# Altium schematic sheet NG2094_USB.SchDoc: =project_title
size Tabloid; PageSetup: Record=PageOptions|CenterHorizontal=True|CenterVertical=True|PrintScale=0.73|XCorrection=1.00|YCorrection=1.00|PrintKind=0|BorderSize=5000000|LeftOffset=0|BottomOffset=0|Orientation=2|PaperLength=1000|PaperWidth=1000|Scale=100|PaperSource=7|PrintQuality=-4|MediaType=1|DitherType=10|PaperKind=A4|PrintScaleMode=1; CompanyName: Luxonis Holding; Organization: Luxonis Holding; Address1: 1925 Harmony Park Drive; Address2: Westminster, CO; Address3: 80234; Address4: United States; SheetNumber: 8; SheetTotal: 12
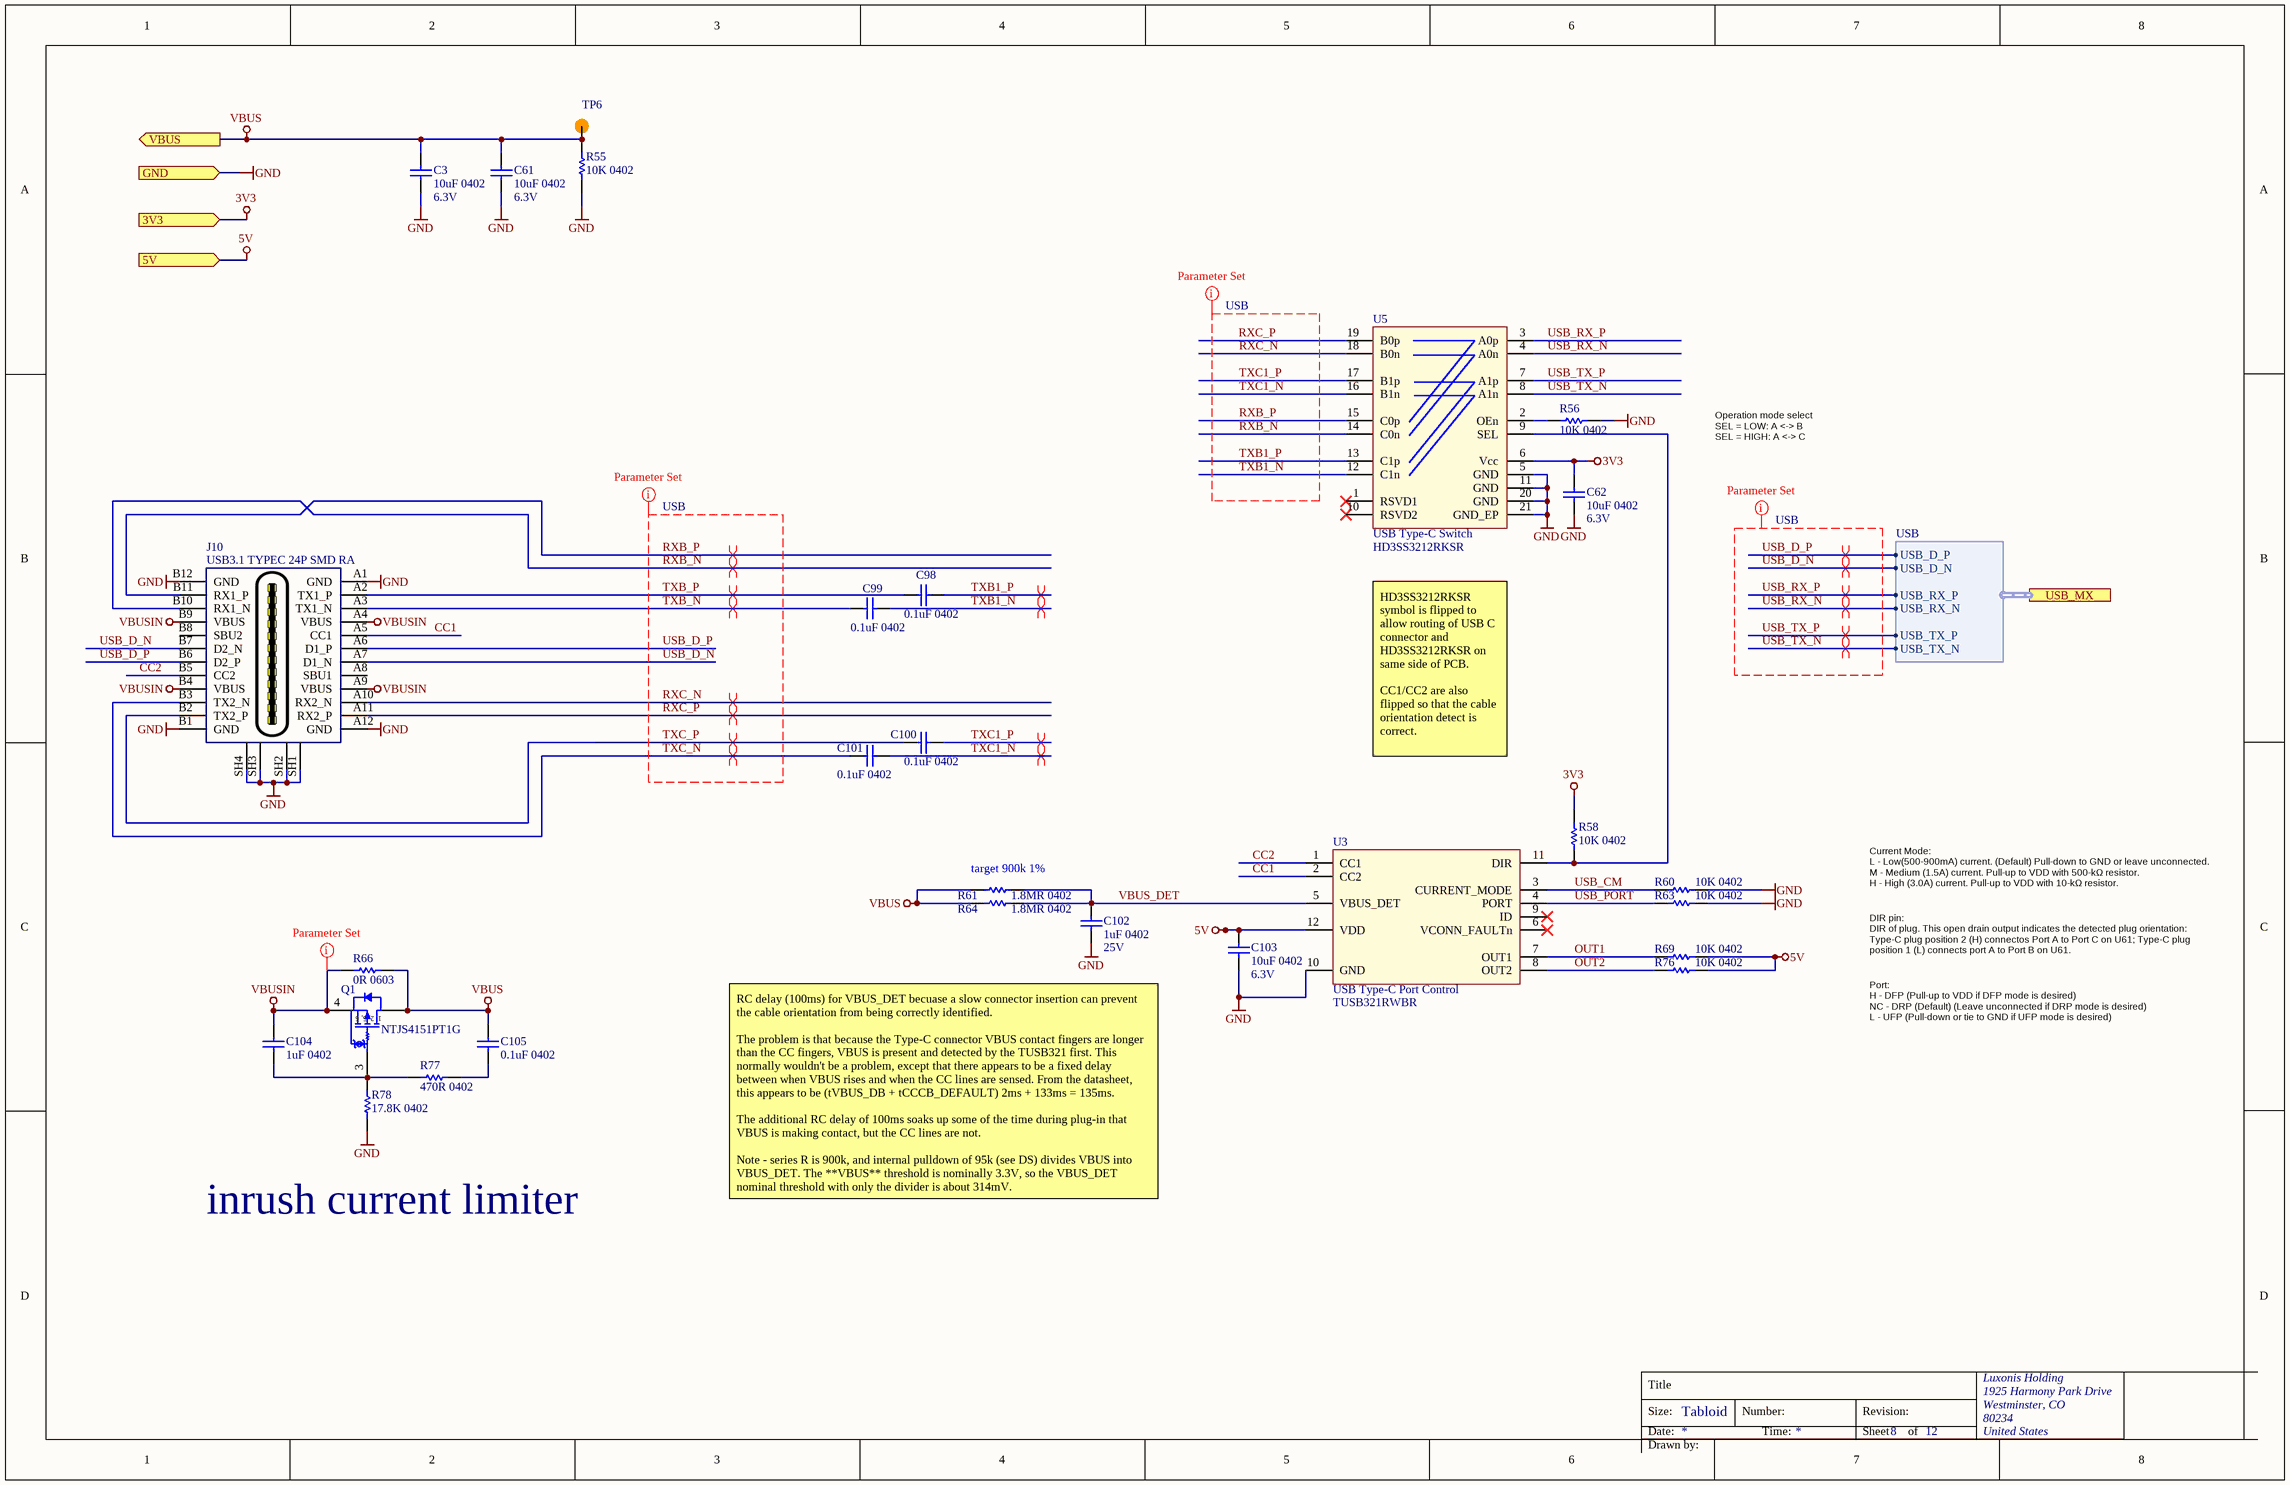
[diagram p0: NG2094_USB.SchDoc]

## Parts
C3  10uF 0402  Voltage Rating: 6.3V  [CAPC0402(1005)70_L]
C61  10uF 0402  Voltage Rating: 6.3V  [CAPC0402(1005)70_L]
C62  10uF 0402  Voltage Rating: 6.3V  [CAPC0402(1005)70_L]
C98  0.1uF 0402  [CAPC0402(1005)70_L]
C99  0.1uF 0402  [CAPC0402(1005)70_L]
C100  0.1uF 0402  [CAPC0402(1005)70_L]
C101  0.1uF 0402  [CAPC0402(1005)70_L]
C102  1uF 0402  Voltage Rating: 25V  [CAPC0402(1005)70_L]
C103  10uF 0402  Voltage Rating: 6.3V  [CAPC0402(1005)70_L]
C104  1uF 0402  [CAPC0402(1005)70_L]
C105  0.1uF 0402  [CAPC0402(1005)70_L]
J10  USB3.1 TYPEC 24P SMD RA  [105450-0101]
Q1  NTJS4151PT1G  [ONSC-SC70-6-419B-02_W_V]
R55  10K 0402  [RESC0402(1005)_L]
R56  10K 0402  [RESC0402(1005)_L]
R58  10K 0402  [RESC0402(1005)_L]
R60  10K 0402  [RESC0402(1005)_L]
R61  1.8MR 0402  [RESC0402(1005)_L]
R63  10K 0402  [RESC0402(1005)_L]
R64  1.8MR 0402  [RESC0402(1005)_L]
R66  0R 0603  [RESC0603(1608)_L]
R69  10K 0402  [RESC0402(1005)_L]
R76  10K 0402  [RESC0402(1005)_L]
R77  470R 0402  [RESC0402(1005)_L]
R78  17.8K 0402  [RESC0402(1005)_L]
TP6  TP100_200_NS  [TP100_200_NS]  (value not drawn)  (no BOM)
U3  USB Type-C Port Control  [TUSB321RWBR]
U5  USB Type-C Switch  [HD3SS3212RKSR]

## Ports
3V3 (in), 5V (in), GND (in), USB_MX (harness USB), VBUS (out)

## Harnesses
USB: USB_D_P, USB_D_N, USB_TX_N, USB_TX_P, USB_RX_N, USB_RX_P

## Nets
3V3: C62.2 R58.2 U5.6(Vcc) ; port 3V3
5V: C103.2 R69.2 R76.2 U3.12(VDD) ; port 5V
GND: C3.1 C61.1 C62.1 C102.1 C103.1 J10.A1(GND) J10.A12(GND) J10.B1(GND) J10.B12(GND) J10.SH1(SH) J10.SH2(SH) J10.SH3(SH) J10.SH4(SH) R55.1 R56.2 R60.2 R63.2 R78.1 U3.10(GND) U5.5(GND) U5.11(GND) U5.20(GND) U5.21(GND_EP) ; port GND
VBUS: C3.2 C61.2 C105.2 Q1.1(D) Q1.2(D) Q1.5(D) Q1.6(D) R55.2 R61.1 R64.1 R66.2 TP6.1 ; port VBUS
VBUSIN: C104.2 J10.A4(VBUS) J10.A9(VBUS) J10.B4(VBUS) J10.B9(VBUS) Q1.4(S) R66.1
CC1: J10.A5(CC1) U3.2(CC2)
CC2: J10.B5(CC2) U3.1(CC1)
OUT1: R69.1 U3.7(OUT1)
OUT2: R76.1 U3.8(OUT2)
RXB_N: J10.B10(RX1_N) U5.14(C0n)
RXB_P: J10.B11(RX1_P) U5.15(C0p)
RXC_N: J10.A10(RX2_N) U5.18(B0n)
RXC_P: J10.A11(RX2_P) U5.19(B0p)
TXB1_N: C99.2 U5.12(C1n)
TXB1_P: C98.2 U5.13(C1p)
TXB_N: C99.1 J10.A3(TX1_N)
TXB_P: C98.1 J10.A2(TX1_P)
TXC1_N: C101.2 U5.16(B1n)
TXC1_P: C100.2 U5.17(B1p)
TXC_N: C101.1 J10.B3(TX2_N)
TXC_P: C100.1 J10.B2(TX2_P)
USB_CM: R60.1 U3.3(CURRENT_MODE)
USB_D_N: J10.A7(D1_N) J10.B7(D2_N) ; port USB_MX.USB_D_N
USB_D_P: J10.A6(D1_P) J10.B6(D2_P) ; port USB_MX.USB_D_P
USB_PORT: R63.1 U3.4(PORT)
USB_RX_N: U5.4(A0n) ; port USB_MX.USB_RX_N
USB_RX_P: U5.3(A0p) ; port USB_MX.USB_RX_P
USB_TX_N: U5.8(A1n) ; port USB_MX.USB_TX_N
USB_TX_P: U5.7(A1p) ; port USB_MX.USB_TX_P
VBUS_DET: C102.2 R61.2 R64.2 U3.5(VBUS_DET)
NetC104_1: C104.1 Q1.3(G) R77.1 R78.2
NetC105_1: C105.1 R77.2
NetR56_1: R56.1 U5.2(OEn)
NetR58_1: R58.1 U3.11(DIR) U5.9(SEL)

Not connected (* = marked no-connect by the designer): J10 A8(SBU1) B8(SBU2); U3 6(VCONN_FAULTn)* 9(ID)*; U5 1(RSVD1)* 10(RSVD2)*

## Layout directives
differential pair; differential pair class USB3: RXB_N, RXB_P, RXC_N, RXC_P, TXB1_N, TXB1_P, TXB_N, TXB_P, TXC1_N, TXC1_P, TXC_N, TXC_P, USB_D_N, USB_D_P, USB_RX_N, USB_RX_P, USB_TX_N, USB_TX_P
net class USB: RXB_N, RXB_P, RXC_N, RXC_P, TXB1_N, TXB1_P, TXB_N, TXB_P, TXC1_N, TXC1_P, TXC_N, TXC_P, USB_D_N, USB_D_P, USB_RX_N, USB_RX_P, USB_TX_N, USB_TX_P
net class POWER: VBUSIN

## Notes on the sheet
- Operation mode select
  SEL = LOW: A <-> B
  SEL = HIGH: A <-> C
- HD3SS3212RKSR symbol is flipped to allow routing of USB C connector and HD3SS3212RKSR on same side of PCB.
  CC1/CC2 are also flipped so that the cable orientation detect is correct.
- (near R61) target 900k 1%
- Current Mode:
  L - Low(500-900mA) current. (Default) Pull-down to GND or leave unconnected.
  M - Medium (1.5A) current. Pull-up to VDD with 500-kΩ resistor.
  H - High (3.0A) current. Pull-up to VDD with 10-kΩ resistor.
- DIR pin:
  DIR of plug. This open drain output indicates the detected plug orientation: Type-C plug position 2 (H) connectos Port A to Port C on U61; Type-C plug position 1 (L) connects port A to Port B on U61.
- Port:
  H - DFP (Pull-up to VDD if DFP mode is desired)
  NC - DRP (Default) (Leave unconnected if DRP mode is desired)
  L - UFP (Pull-down or tie to GND if UFP mode is desired)
- inrush current limiter
- RC delay (100ms) for VBUS_DET becuase a slow connector insertion can prevent the cable orientation from being correctly identified.
  The problem is that because the Type-C connector VBUS contact fingers are longer than the CC fingers, VBUS is present and detected by the TUSB321 first. This normally wouldn't be a problem, except that there appears to be a fixed delay between when VBUS rises and when the CC lines are sensed. From the datasheet, this appears to be (tVBUS_DB + tCCCB_DEFAULT) 2ms + 133ms = 135ms.
  The additional RC delay of 100ms soaks up some of the time during plug-in that VBUS is making contact, but the CC lines are not.
  Note - series R is 900k, and internal pulldown of 95k (see DS) divides VBUS into VBUS_DET. The **VBUS** threshold is nominally 3.3V, so the VBUS_DET nominal threshold with only the divider is about 314mV.
- Title
- Size:
- Date:
- Tabloid
- Number:
- Time:
- Revision:
- Sheet
- of
- Drawn by:
- (in symbol NTJS4151PT1G) 1, 2, 5, 6

## Library data of the parts
C3 C61 C62 C103 = GRM155R60J106ME15D: CAP CER 10UF 6.3V X5R 0402 20%; Manufacturer 1: Murata; Supplier 1: Digi-Key; Manufacturer Part Number 1: GRM155R60J106ME15D; Stock 1: 1839627; Pricing 1: 1=0.23000, 10=0.15700, 100=0.07950, 500=0.05442, 1000=0.04814, 2500=0.04605, 5000=0.04186 (USD); RoHS: Yes; Mount: Surface Mount; Case/Package: 0402; Case Code (Metric): 1005; Case Code (Imperial): 0402; Min Operating Temperature: -55°C; Max Operating Temperature: 85°C; Packaging: Tape and Reel; Capacitance: 10uF; Dielectric: X5R; Length: 0.039inch; Width: 0.02inch; ComponentLink1URL: https://www.murata.com/~/media/webrenewal/support/library/catalog/products/capacitor/mlcc/c02e.ashx?la=en-us&src-supplier=Digi-Key; ComponentLink1Description: https://www.murata.com/~/media/webrenewal/support/library/catalog/products/capacitor/mlcc/c02e.ashx?la=en-us&src-supplier=Digi-Key; Supplier Part Number 1: 490-13238-1-ND; Voltage Rating (DC): 6.3V; Thickness: 0.026inch; Tolerance: 20%
C98-C101 C105 = GRM155R71A104JA01D: CAP CER 0.1UF 10V X7R 0402 5%; Manufacturer 1: Murata; Capacitance: 100nF; Supplier 1: Digi-Key; Manufacturer Part Number 1: GRM155R71A104JA01D; Stock 1: 1346709; Pricing 1: 1=0.10000, 10=0.02500, 100=0.01130, 500=0.00806, 1000=0.00633, 2500=0.00575, 5000=0.00529 (USD); RoHS: Yes; Mount: Surface Mount; Case/Package: 0402; Case Code (Imperial): 0402; Case Code (Metric): 1005; Min Operating Temperature: -55°C; Max Operating Temperature: 125°C; Tolerance: 5%; Packaging: Tape and Reel; Voltage Rating (DC): 10V; Dielectric: X7R; Package Quantity: 10000; Termination: SMD/SMT; Length: 1mm; Height: 0.5mm; Width: 0.02inch; Thickness: 0.022inch; Depth: 0.5mm; Radiation Hardening: No; Lead Free: Lead Free; ComponentLink1URL: https://datasheet.ciiva.com/5411/product-5411135.pdf?src-supplier=Mouser; ComponentLink1Description: https://datasheet.ciiva.com/5411/product-5411135.pdf?src-supplier=Mouser; ComponentLink2URL: https://datasheet.ciiva.com/11618/c02e-11618821.pdf?src-supplier=Avnet; ComponentLink2Description: https://datasheet.ciiva.com/11618/c02e-11618821.pdf?src-supplier=Avnet; Supplier Part Number 1: 490-10777-1-ND; Voltage Rating: 10V
C102 C104 = GRM155R61E105KA12D: CAP CER 1UF 25V X5R 0402 10%; Manufacturer 1: Murata; Material: Ceramic; Supplier 1: Digi-Key; Manufacturer Part Number 1: GRM155R61E105KA12D; Stock 1: 200653; Pricing 1: 1=0.10000, 10=0.07100, 100=0.03350, 500=0.02352, 1000=0.01947, 2500=0.01812, 5000=0.01658 (USD); RoHS: Yes; Mount: Surface Mount; Case/Package: 0402; Weight: 0.000212oz; Case Code (Metric): 1005; Case Code (Imperial): 0402; Min Operating Temperature: -55°C; Max Operating Temperature: 85°C; Tolerance: 10%; Capacitance: 1uF; Dielectric: X5R; Voltage Rating (DC): 25V; Packaging: Tape and Reel; Package Quantity: 10000; Termination: SMD/SMT; Voltage: 25V; Length: 1mm; Height: 0.5mm; Width: 0.5mm; Thickness: 0.022inch; Depth: 0.5mm; Lead Free: Lead Free; REACH SVHC: No SVHC; ComponentLink1URL: https://datasheet.ciiva.com/22732/1666664-22732122.pdf?src-supplier=Element14; ComponentLink1Description: https://datasheet.ciiva.com/22732/1666664-22732122.pdf?src-supplier=Element14; ComponentLink2URL: https://datasheet.ciiva.com/7719/1666664-7719006.pdf?src-supplier=Element14; ComponentLink2Description: https://datasheet.ciiva.com/7719/1666664-7719006.pdf?src-supplier=Element14; Supplier Part Number 1: 490-10017-1-ND; Supplier 2: Arrow; Supplier 3: TTI; Supplier Part Number 2: GRM155R61E105KA12D; Supplier Part Number 3: GRM155R61E105KA12D
  C104: Voltage Rating: 25V
J10 = 105450-0101: CONN RCP USB3.1 TYPEC 24P SMD RA; Manufacturer 1: Molex; Connector Type: USB; Number of Contacts: 24; Gender: Receptacle; Number of Ports: 1; Current Rating: 5A; Mating Cycles: 10000; Shielding: Shielded; Pitch: 0.5mm; Supplier 1: Digi-Key; Manufacturer Part Number 1: 105450-0101; Stock 1: 13882; Pricing 1: 1=2.15000, 10=1.94900, 25=1.82960, 50=1.75000, 100=1.67050, 250=1.51140, 500=1.39208 (USD); RoHS: Yes; Mount: Surface Mount,Through Hole,Horizontal; Case/Package: 0101; Number of Pins: 24; Contact Material: Copper Alloy; Contact Plating: Gold; Number of Terminals: 24; Housing Material: Thermoplastic; Insulation Color: Black; Min Operating Temperature: -30°C; Max Operating Temperature: 85°C; Packaging: Tape and Reel; Orientation: Right Angle; Termination: Solder; USB Standard: USB 3.1; Features: Shielded; Length: 8.94mm; REACH SVHC: Unknown; Flammability Rating: UL94 V-0; ComponentLink1URL: http://www.farnell.com/datasheets/2673427.pdf?src-supplier=Farnell; ComponentLink1Description: http://www.farnell.com/datasheets/2673427.pdf?src-supplier=Farnell; ComponentLink2URL: http://www.farnell.com/datasheets/2801634.pdf?src-supplier=Farnell; ComponentLink2Description: http://www.farnell.com/datasheets/2801634.pdf?src-supplier=Farnell; ComponentLink3URL: http://www.farnell.com/datasheets/2672741.pdf?src-supplier=Newark; ComponentLink3Description: http://www.farnell.com/datasheets/2672741.pdf?src-supplier=Newark; ComponentLink4URL: https://www.molex.com/pdm_docs/sd/1054500101_sd.pdf?src-supplier=Digi-Key; ComponentLink4Description: https://www.molex.com/pdm_docs/sd/1054500101_sd.pdf?src-supplier=Digi-Key; ComponentLink5URL: https://www.molex.com/pdm_docs/ps/PS-105448-001.pdf?src-supplier=Digi-Key; ComponentLink5Description: https://www.molex.com/pdm_docs/ps/PS-105448-001.pdf?src-supplier=Digi-Key; ComponentLink6URL: http://www.farnell.com/datasheets/2015275.pdf?src-supplier=Element14; ComponentLink6Description: http://www.farnell.com/datasheets/2015275.pdf?src-supplier=Element14; ComponentLink7URL: http://www.literature.molex.com/SQLImages/kelmscott/Molex/PDF_Images/987651-4081.PDF?src-supplier=Avnet; ComponentLink7Description: http://www.literature.molex.com/SQLImages/kelmscott/Molex/PDF_Images/987651-4081.PDF?src-supplier=Avnet; ComponentLink8URL: http://www.literature.molex.com/SQLImages/kelmscott/Molex/PDF_Images/987651-4081.PDF?src-supplier=Avnet+Asia; ComponentLink8Description: http://www.literature.molex.com/SQLImages/kelmscott/Molex/PDF_Images/987651-4081.PDF?src-supplier=Avnet+Asia; Supplier Part Number 1: WM12856CT-ND
Q1 = NTJS4151PT1G: Trench Power MOSFET, -20 V, -4.2 A, Single P-Channel, 6-Pin SC70, Pb-Free, Tape and Reel; Manufacturer 1: ON Semiconductor; VGS(th) Max (V): 1.2; VGS Max (V): 12; Crss Typ (pF): 110; Ciss Typ (pF): 850; PD Max (W): 1; Qrr Typ (nC): 0.23; ID Max (A): 4.2; Coss Typ (pF): 160; Channel Polarity: P Channel; V(BR)DSS Min (V): 20; Mounting Technology: Surface Mount; ComponentLink3Description: Package Specification; Packing: Tape and Reel; DatasheetVersion: Rev. 1; RoHS: Pb-Free; Configuration: Single; PackageReference: SC70-6-419B-02_W; PackageVersion: Rev. W; Package Type: SC-88-6 / SC-70-6 / SOT-363-6; ComponentLink3URL: http://www.onsemi.com/pub_link/Collateral/SMF05C-D.PDF; PackageDescription: 6-Pin Small Outline Transistor, Body 2 x 1.25 mm, Pitch 0.65 mm; PartNumber: NTJS4151PT1G; ComponentLink2Description: Datasheet; ComponentLink1Description: Manufacturer URL; ComponentLink2URL: http://www.onsemi.com/pub_link/Collateral/NTJS4151P-D.PDF; ComponentLink1URL: http://www.onsemi.com/; Manufacturer Part Number 1: NTJS4151PT1G
R55 R56 R58 R60 R63 R69 R76 = RC0402FR-1310KL: RES SMD 10K OHM 1% 0402 1/16W Chip Resistor, 0402 [1005 Metric], 10 kohm, RC Series, 50 V, Thick Film, 62.5 mW; Manufacturer 1: Yageo; Resistance: 10kR; Temperature Coefficient: 100ppm/°C; Power Rating: 62.5mW; Voltage Rating: 50V; ComponentLink1URL: https://datasheet.ciiva.com/16940/pyu-rc0402-51-rohs-l-6-16940293.pdf?src-supplier=Avnet+Europe; ComponentLink1Description: https://datasheet.ciiva.com/16940/pyu-rc0402-51-rohs-l-6-16940293.pdf?src-supplier=Avnet+Europe; ComponentLink2URL: https://datasheet.ciiva.com/28386/pyu-rc0402-51-rohs-l-6-28386855.pdf?src-supplier=Avnet+Europe; ComponentLink2Description: https://datasheet.ciiva.com/28386/pyu-rc0402-51-rohs-l-6-28386855.pdf?src-supplier=Avnet+Europe; ComponentLink3URL: https://datasheet.ciiva.com/16740/pyu-rc0402-51-rohs-l-6-r-16740602.pdf?src-supplier=Future+Electronics; ComponentLink3Description: https://datasheet.ciiva.com/16740/pyu-rc0402-51-rohs-l-6-r-16740602.pdf?src-supplier=Future+Electronics; ComponentLink4URL: https://datasheet.ciiva.com/8891/pyu-rc0402-51-rohs-l-6-8891339.pdf?src-supplier=Avnet; ComponentLink4Description: https://datasheet.ciiva.com/8891/pyu-rc0402-51-rohs-l-6-8891339.pdf?src-supplier=Avnet; ComponentLink5URL: https://datasheet.ciiva.com/5557/pyu-rc0402-51-rohs-l-6-r-5557997.pdf?src-supplier=Mouser; ComponentLink5Description: https://datasheet.ciiva.com/5557/pyu-rc0402-51-rohs-l-6-r-5557997.pdf?src-supplier=Mouser; ComponentLink6URL: https://datasheet.ciiva.com/7983/1018594-7983533.pdf?src-supplier=Element14; ComponentLink6Description: https://datasheet.ciiva.com/7983/1018594-7983533.pdf?src-supplier=Element14; Supplier 1: Newark; Manufacturer Part Number 1: RC0402FR-1310KL; Stock 1: 62239; Pricing 1: 1=0.10000, 25=0.01200, 100=0.00400, 250=0.00400, 500=0.00300, 1000=0.00300 (USD); RoHS: Yes; Case/Package: 0402; Number of Pins: 2; Contact Plating: Tin,Matte,Lead; Case Code (Imperial): 0402; Case Code (Metric): 1005; Min Operating Temperature: -55°C; Max Operating Temperature: 155°C; Tolerance: 1%; Composition: Thick Film; Packaging: Tape and Reel; Termination: SMD/SMT; Military Standard: Not; Voltage Rating (DC): 50V; Working Voltage: 50V; Number of Terminations: 2; Length: 1mm; Depth: 0.5mm; Radiation Hardening: No; REACH SVHC: No SVHC; Lead Free: Lead Free; Supplier Part Number 1: 67R9960
R61 R64 = CRCW04021M80FKED: RES SMD 1.8M OHM 1% 1/16W 0402; Manufacturer 1: Vishay; Voltage Rating: 50V; Temperature Coefficient: 100ppm/°C; Power Rating: 63mW; Supplier 1: Digi-Key; Manufacturer Part Number 1: CRCW04021M80FKED; Stock 1: 26061; Pricing 1: 1=0.10000, 10=0.03800, 100=0.01540, 1000=0.00690, 2500=0.00599, 5000=0.00495 (USD); RoHS: Yes; Mount: Surface Mount; Case/Package: 0402; Number of Pins: 2; Weight: 2.3E-05oz; Case Code (Imperial): 0402; Case Code (Metric): 1005; Contact Plating: Tin; Min Operating Temperature: -55°C; Max Operating Temperature: 155°C; Packaging: Tape and Reel; Package Quantity: 10000; Termination: SMD/SMT; Voltage Rating (DC): 50V; Composition: Thick Film; Tolerance: 1%; Military Standard: Not; Resistance: 1.8MR; Length: 1mm; Height: 0.35mm; Width: 0.5mm; Depth: 0.5mm; Radiation Hardening: No; Lead Free: Lead Free; REACH SVHC: Unknown; ComponentLink1URL: https://datasheet.ciiva.com/11812/0900766b80d98824-11812579.pdf?src-supplier=RSComponents; ComponentLink1Description: https://datasheet.ciiva.com/11812/0900766b80d98824-11812579.pdf?src-supplier=RSComponents; ComponentLink2URL: https://datasheet.ciiva.com/16886/dcrcwe3-16886536.pdf?src-supplier=Avnet+Europe; ComponentLink2Description: https://datasheet.ciiva.com/16886/dcrcwe3-16886536.pdf?src-supplier=Avnet+Europe; ComponentLink3URL: https://datasheet.ciiva.com/7800/1697337-7800987.pdf?src-supplier=Element14; ComponentLink3Description: https://datasheet.ciiva.com/7800/1697337-7800987.pdf?src-supplier=Element14; ComponentLink4URL: https://datasheet.ciiva.com/16786/70201119-16786875.pdf?src-supplier=Allied+Electronics; ComponentLink4Description: https://datasheet.ciiva.com/16786/70201119-16786875.pdf?src-supplier=Allied+Electronics; ComponentLink5URL: https://datasheet.ciiva.com/22676/1700796-22676027.pdf?src-supplier=Element14; ComponentLink5Description: https://datasheet.ciiva.com/22676/1700796-22676027.pdf?src-supplier=Element14; ComponentLink6URL: https://datasheet.ciiva.com/7800/1697337-7800988.pdf?src-supplier=Element14; ComponentLink6Description: https://datasheet.ciiva.com/7800/1697337-7800988.pdf?src-supplier=Element14; ComponentLink7URL: https://datasheet.ciiva.com/26316/fld-crcw-e3-data-en-26316605.pdf?src-supplier=Distrelec; ComponentLink7Description: https://datasheet.ciiva.com/26316/fld-crcw-e3-data-en-26316605.pdf?src-supplier=Distrelec; ComponentLink8URL: https://datasheet.ciiva.com/8336/dcrcwe3-8336646.pdf?src-supplier=Avnet; ComponentLink8Description: https://datasheet.ciiva.com/8336/dcrcwe3-8336646.pdf?src-supplier=Avnet; Supplier Part Number 1: 541-1.80MLCT-ND
R66 = CRCW06030000Z0EA: RES SMD 0 OHM JUMPER 1/10W 0603 0 Ohms Jumper 0.1W, 1/10W Chip Resistor 0603 (1608 Metric) Automotive AEC-Q200 Thick Film; Manufacturer 1: Vishay; Manufacturer Part Number 1: CRCW0603-0000Z0EA; Resistance: 0mR; Power Rating: 100mW; Voltage Rating: 75V; Temperature Coefficient: 100ppm/°C; Tolerance: 5%; Current Rating: 2A; Supplier 1: Digi-Key; Stock 1: 742743; Pricing 1: 1=0.100000, 10=0.034000, 25=0.024400, 50=0.018600, 100=0.013800, 250=0.010480, 500=0.008400, 1000=0.006180 (USD); RoHS: Yes; Mount: Surface Mount; Case/Package: 0603; Weight: 7.1E-05oz; Contact Plating: Tin,Lead; Case Code (Metric): 1608; Case Code (Imperial): 0603; Min Operating Temperature: -55°C; Max Operating Temperature: 155°C; Composition: Thick Film; Termination: SMD/SMT; Packaging: Tape and Reel; Package Quantity: 1; Number of Terminations: 2; Military Standard: Not; Max Power Dissipation: 100mW; Voltage Rating (DC): 75V; Features: Automotive AEC-Q200; Working Voltage: 75V; Length: 1.55mm; Height: 0.02inch; Width: 0.033inch; Depth: 0.85mm; Radiation Hardening: No; Lead Free: Lead Free; REACH SVHC: Unknown; ComponentLink1URL: https://datasheet.ciiva.com/2461/dcrcwe3-2461968.pdf?src-supplier=Digi-Key; ComponentLink1Description: https://datasheet.ciiva.com/2461/dcrcwe3-2461968.pdf?src-supplier=Digi-Key; ComponentLink2URL: https://datasheet.ciiva.com/2461/dcrcwe3-2461969.pdf?src-supplier=Digi-Key; ComponentLink2Description: https://datasheet.ciiva.com/2461/dcrcwe3-2461969.pdf?src-supplier=Digi-Key; ComponentLink3URL: https://datasheet.ciiva.com/2461/dcrcwe3-2461970.pdf?src-supplier=Digi-Key; ComponentLink3Description: https://datasheet.ciiva.com/2461/dcrcwe3-2461970.pdf?src-supplier=Digi-Key; ComponentLink4URL: https://datasheet.ciiva.com/8340/dcrcwe3-8340197.pdf?src-supplier=Avnet; ComponentLink4Description: https://datasheet.ciiva.com/8340/dcrcwe3-8340197.pdf?src-supplier=Avnet; ComponentLink5URL: https://datasheet.ciiva.com/16941/dcrcw-16941302.pdf?src-supplier=Avnet+Europe; ComponentLink5Description: https://datasheet.ciiva.com/16941/dcrcw-16941302.pdf?src-supplier=Avnet+Europe; ComponentLink6URL: https://datasheet.ciiva.com/16199/dcrcwe3-16199063.pdf?src-supplier=Future+Electronics; ComponentLink6Description: https://datasheet.ciiva.com/16199/dcrcwe3-16199063.pdf?src-supplier=Future+Electronics; ComponentLink7URL: https://datasheet.ciiva.com/16725/70201119-16725175.pdf?src-supplier=Allied+Electronics; ComponentLink7Description: https://datasheet.ciiva.com/16725/70201119-16725175.pdf?src-supplier=Allied+Electronics; ComponentLink8URL: https://datasheet.ciiva.com/26316/fld-crcw-e3-data-en-26316615.pdf?src-supplier=Distrelec; ComponentLink8Description: https://datasheet.ciiva.com/26316/fld-crcw-e3-data-en-26316615.pdf?src-supplier=Distrelec; ComponentLink9URL: https://datasheet.ciiva.com/5544/dcrcwe3-109170-5544344.pdf?src-supplier=Mouser; ComponentLink9Description: https://datasheet.ciiva.com/5544/dcrcwe3-109170-5544344.pdf?src-supplier=Mouser; ComponentLink10URL: https://datasheet.ciiva.com/7841/1720486-7841816.pdf?src-supplier=Element14; ComponentLink10Description: https://datasheet.ciiva.com/7841/1720486-7841816.pdf?src-supplier=Element14; ComponentLink11URL: https://datasheet.ciiva.com/7841/1720486-7841817.pdf?src-supplier=Element14; ComponentLink11Description: https://datasheet.ciiva.com/7841/1720486-7841817.pdf?src-supplier=Element14; ComponentLink12URL: https://datasheet.ciiva.com/7841/125364-7841818.pdf?src-supplier=Element14; ComponentLink12Description: https://datasheet.ciiva.com/7841/125364-7841818.pdf?src-supplier=Element14; ComponentLink13URL: https://datasheet.ciiva.com/16721/70201119-16721450.pdf?src-supplier=Allied+Electronics; ComponentLink13Description: https://datasheet.ciiva.com/16721/70201119-16721450.pdf?src-supplier=Allied+Electronics; Supplier Part Number 1: 541-0.0GCT-ND
R77 = CRCW0402470RFKED: RES SMD 470 OHM 1% 1/16W 0402; Manufacturer 1: Vishay; Temperature Coefficient: 100ppm/°C; Power Rating: 63mW; Voltage Rating: 50V; Supplier 1: Digi-Key; Manufacturer Part Number 1: CRCW0402470RFKED; Stock 1: 9199; Pricing 1: 1=0.10000, 10=0.03800, 100=0.01540, 1000=0.00690, 2500=0.00599, 5000=0.00495 (USD); RoHS: Yes; Mount: Surface Mount; Case/Package: 0402; Weight: 2.3E-05oz; Case Code (Imperial): 0402; Case Code (Metric): 1005; Contact Plating: Tin; Min Operating Temperature: -55°C; Max Operating Temperature: 155°C; Resistance: 470R; Tolerance: 1%; Composition: Thick Film; Packaging: Tape and Reel; Voltage Rating (DC): 50V; Termination: SMD/SMT; Number of Terminations: 2; Package Quantity: 10; Military Standard: Not; Max Power Dissipation: 63mW; Features: Automotive AEC-Q200; Length: 1mm; Height: 0.35mm; Width: 0.5mm; Depth: 0.5mm; Radiation Hardening: No; REACH SVHC: Unknown; Lead Free: Lead Free; ComponentLink1URL: https://datasheet.ciiva.com/11811/0900766b80d98824-11811416.pdf?src-supplier=RSComponents; ComponentLink1Description: https://datasheet.ciiva.com/11811/0900766b80d98824-11811416.pdf?src-supplier=RSComponents; ComponentLink2URL: https://datasheet.ciiva.com/16764/70201119-16764886.pdf?src-supplier=Allied+Electronics; ComponentLink2Description: https://datasheet.ciiva.com/16764/70201119-16764886.pdf?src-supplier=Allied+Electronics; ComponentLink3URL: https://datasheet.ciiva.com/28613/1720486-28613479.pdf?src-supplier=Element14; ComponentLink3Description: https://datasheet.ciiva.com/28613/1720486-28613479.pdf?src-supplier=Element14; ComponentLink4URL: https://datasheet.ciiva.com/3256/dcrcwe3-3256553.pdf?src-supplier=Avnet; ComponentLink4Description: https://datasheet.ciiva.com/3256/dcrcwe3-3256553.pdf?src-supplier=Avnet; ComponentLink5URL: https://datasheet.ciiva.com/7777/1720486-7777243.pdf?src-supplier=Element14; ComponentLink5Description: https://datasheet.ciiva.com/7777/1720486-7777243.pdf?src-supplier=Element14; ComponentLink6URL: https://datasheet.ciiva.com/8336/dcrcwe3-8336715.pdf?src-supplier=Avnet; ComponentLink6Description: https://datasheet.ciiva.com/8336/dcrcwe3-8336715.pdf?src-supplier=Avnet; ComponentLink7URL: https://datasheet.ciiva.com/7777/1697337-7777244.pdf?src-supplier=Element14; ComponentLink7Description: https://datasheet.ciiva.com/7777/1697337-7777244.pdf?src-supplier=Element14; ComponentLink8URL: https://datasheet.ciiva.com/2463/dcrcwe3-2463085.pdf?src-supplier=Digi-Key; ComponentLink8Description: https://datasheet.ciiva.com/2463/dcrcwe3-2463085.pdf?src-supplier=Digi-Key; ComponentLink9URL: https://datasheet.ciiva.com/16362/dcrcwe3-16362109.pdf?src-supplier=Future+Electronics; ComponentLink9Description: https://datasheet.ciiva.com/16362/dcrcwe3-16362109.pdf?src-supplier=Future+Electronics; ComponentLink10URL: https://datasheet.ciiva.com/16882/dcrcwe3-16882493.pdf?src-supplier=Avnet+Europe; ComponentLink10Description: https://datasheet.ciiva.com/16882/dcrcwe3-16882493.pdf?src-supplier=Avnet+Europe; ComponentLink11URL: https://datasheet.ciiva.com/2463/dcrcwe3-2463086.pdf?src-supplier=Digi-Key; ComponentLink11Description: https://datasheet.ciiva.com/2463/dcrcwe3-2463086.pdf?src-supplier=Digi-Key; ComponentLink12URL: https://datasheet.ciiva.com/2463/dcrcwe3-2463087.pdf?src-supplier=Digi-Key; ComponentLink12Description: https://datasheet.ciiva.com/2463/dcrcwe3-2463087.pdf?src-supplier=Digi-Key; Supplier 2: Newark; Supplier Part Number 1: 541-470LCT-ND; Supplier Part Number 2: 26W9133
R78 = ERJ-2RKF1782X: RES SMD 17.8K OHM 1% 1/10W 0402 17.8 kOhms ±1% 0.1W, 1/10W Chip Resistor 0402 (1005 Metric) Automotive AEC-Q200 Thick Film; Manufacturer 1: Panasonic; Temperature Coefficient: 100ppm/°C; Power Rating: 100mW; Voltage Rating: 50V; Resistance: 17.8kR; RoHS: Yes; Mount: Surface Mount; Case Code (Metric): 1005; Case Code (Imperial): 0402; Contact Plating: Tin; Min Operating Temperature: -55°C; Max Operating Temperature: 155°C; Packaging: Tape and Reel; Composition: Thick Film; Termination: SMD/SMT; Package Quantity: 1; Voltage Rating (DC): 50V; Military Standard: Not; Number of Terminations: 2; Max Power Dissipation: 100mW; Features: Automotive AEC-Q200; Length: 1mm; Height: 0.35mm; Width: 0.02inch; Depth: 0.5mm; Lead Free: Lead Free; REACH SVHC: Unknown; ComponentLink1URL: https://datasheet.ciiva.com/24027/aoa0000ce2-24027013.pdf?src-supplier=Mouser; ComponentLink1Description: https://datasheet.ciiva.com/24027/aoa0000ce2-24027013.pdf?src-supplier=Mouser; ComponentLink2URL: https://datasheet.ciiva.com/46372/1678782-46372997.pdf?src-supplier=Element14; ComponentLink2Description: https://datasheet.ciiva.com/46372/1678782-46372997.pdf?src-supplier=Element14; ComponentLink3URL: https://datasheet.ciiva.com/28594/1694929-28594534.pdf?src-supplier=Element14; ComponentLink3Description: https://datasheet.ciiva.com/28594/1694929-28594534.pdf?src-supplier=Element14; ComponentLink4URL: https://datasheet.ciiva.com/46372/1678782-46372998.pdf?src-supplier=Element14; ComponentLink4Description: https://datasheet.ciiva.com/46372/1678782-46372998.pdf?src-supplier=Element14; ComponentLink5URL: https://datasheet.ciiva.com/22764/1678782-22764807.pdf?src-supplier=Farnell; ComponentLink5Description: https://datasheet.ciiva.com/22764/1678782-22764807.pdf?src-supplier=Farnell; ComponentLink6URL: https://datasheet.ciiva.com/16769/70260748-16769816.pdf?src-supplier=Allied+Electronics; ComponentLink6Description: https://datasheet.ciiva.com/16769/70260748-16769816.pdf?src-supplier=Allied+Electronics; ComponentLink7URL: https://datasheet.ciiva.com/30116/aoa0000ce2-30116554.pdf?src-supplier=Onlinecomponents.com; ComponentLink7Description: https://datasheet.ciiva.com/30116/aoa0000ce2-30116554.pdf?src-supplier=Onlinecomponents.com; ComponentLink8URL: https://datasheet.ciiva.com/16775/70260748-16775211.pdf?src-supplier=Allied+Electronics; ComponentLink8Description: https://datasheet.ciiva.com/16775/70260748-16775211.pdf?src-supplier=Allied+Electronics; ComponentLink9URL: https://datasheet.ciiva.com/43467/1678782-43467419.pdf?src-supplier=Farnell; ComponentLink9Description: https://datasheet.ciiva.com/43467/1678782-43467419.pdf?src-supplier=Farnell; ComponentLink10URL: https://datasheet.ciiva.com/22668/1678782-22668623.pdf?src-supplier=Element14; ComponentLink10Description: https://datasheet.ciiva.com/22668/1678782-22668623.pdf?src-supplier=Element14; Supplier 1: Digi-Key; Manufacturer Part Number 1: ERJ-2RKF1782X; Stock 1: 250542; Pricing 1: 1=0.10000, 10=0.04500, 100=0.01830, 1000=0.00823, 2500=0.00715, 5000=0.00590 (USD); Case/Package: 0402; Tolerance: 1%; Supplier Part Number 1: P17.8KLCT-ND
TP6 = TEST_POINT
U3 = TUSB321RWBR: IC USB PORT CONTROL TYPE-C 12X2Q; Manufacturer 1: Texas Instruments; Min Supply Voltage: 4.5V; Max Supply Voltage: 5.5V; Number of Ports: 1; USB Standard: USB 3.1; Supplier 1: Digi-Key; Manufacturer Part Number 1: TUSB321RWBR; Stock 1: 7746; Pricing 1: 1=2.27000, 10=2.04200, 100=1.64100, 500=1.34828, 1000=1.11714 (USD); RoHS: Yes; Mount: Surface Mount; Number of Pins: 12; Contact Plating: Gold; Min Operating Temperature: 0°C; Max Operating Temperature: 70°C; Packaging: Tape and Reel; REACH SVHC: No SVHC; Lead Free: Lead Free; ComponentLink1URL: http://www.ti.com/general/docs/lit/getliterature.tsp?genericPartNumber=TUSB321&&fileType=pdf&src-supplier=Avnet+Asia; ComponentLink1Description: http://www.ti.com/general/docs/lit/getliterature.tsp?genericPartNumber=TUSB321&&fileType=pdf&src-supplier=Avnet+Asia; ComponentLink2URL: http://www.ti.com/general/docs/lit/getliterature.tsp?genericPartNumber=TUSB321&&fileType=pdf&src-supplier=Farnell; ComponentLink2Description: http://www.ti.com/general/docs/lit/getliterature.tsp?genericPartNumber=TUSB321&&fileType=pdf&src-supplier=Farnell; ComponentLink3URL: http://www.ti.com/lit/ds/symlink/tusb321.pdf?src-supplier=Digi-Key; ComponentLink3Description: http://www.ti.com/lit/ds/symlink/tusb321.pdf?src-supplier=Digi-Key; ComponentLink4URL: http://www.ti.com/general/docs/lit/getliterature.tsp?genericPartNumber=TUSB321&&fileType=pdf&src-supplier=Element14; ComponentLink4Description: http://www.ti.com/general/docs/lit/getliterature.tsp?genericPartNumber=TUSB321&&fileType=pdf&src-supplier=Element14; ComponentLink5URL: http://www.ti.com/general/docs/lit/getliterature.tsp?genericPartNumber=TUSB321&&fileType=pdf&src-supplier=Avnet; ComponentLink5Description: http://www.ti.com/general/docs/lit/getliterature.tsp?genericPartNumber=TUSB321&&fileType=pdf&src-supplier=Avnet; Supplier Part Number 1: 296-42400-1-ND
U5 = HD3SS3212RKSR: IC MUX 2:1 8 OHM 20VQFN; Manufacturer 1: Texas Instruments; Bandwidth: 8GHz; Min Supply Voltage: 3V; Max Supply Voltage: 3.6V; Data Rate: 480Mbps; Number of Ports: 3; USB Standard: USB 3.1; Supplier 1: Digi-Key; Manufacturer Part Number 1: HD3SS3212RKSR; Stock 1: 36674; Pricing 1: 1=1.79000, 10=1.61000, 100=1.29440, 500=1.06348, 1000=0.88117 (USD); RoHS: Yes; Mount: Standard; Case/Package: VQFN; Number of Pins: 20; Min Operating Temperature: 0°C; Max Operating Temperature: 70°C; Packaging: Tape and Reel; Lead Free: Lead Free; REACH SVHC: No SVHC; ComponentLink1URL: http://www.ti.com/general/docs/lit/getliterature.tsp?genericPartNumber=HD3SS3212&&fileType=pdf&src-supplier=Avnet; ComponentLink1Description: http://www.ti.com/general/docs/lit/getliterature.tsp?genericPartNumber=HD3SS3212&&fileType=pdf&src-supplier=Avnet; ComponentLink2URL: http://www.ti.com/general/docs/lit/getliterature.tsp?genericPartNumber=HD3SS3212&amp;&amp;fileType=pdf&src-supplier=Farnell; ComponentLink2Description: http://www.ti.com/general/docs/lit/getliterature.tsp?genericPartNumber=HD3SS3212&amp;&amp;fileType=pdf&src-supplier=Farnell; ComponentLink3URL: http://www.ti.com/lit/ds/symlink/hd3ss3212.pdf?src-supplier=Digi-Key; ComponentLink3Description: http://www.ti.com/lit/ds/symlink/hd3ss3212.pdf?src-supplier=Digi-Key; ComponentLink4URL: http://www.ti.com/lit/gpn/hd3ss3212?src-supplier=Mouser; ComponentLink4Description: http://www.ti.com/lit/gpn/hd3ss3212?src-supplier=Mouser; ComponentLink5URL: http://www.ti.com/general/docs/lit/getliterature.tsp?genericPartNumber=HD3SS3212&&fileType=pdf&src-supplier=Element14; ComponentLink5Description: http://www.ti.com/general/docs/lit/getliterature.tsp?genericPartNumber=HD3SS3212&&fileType=pdf&src-supplier=Element14; Supplier Part Number 1: 296-42174-1-ND